# EAGLE schematic VA-Meter (EAGLE 6.6.0)
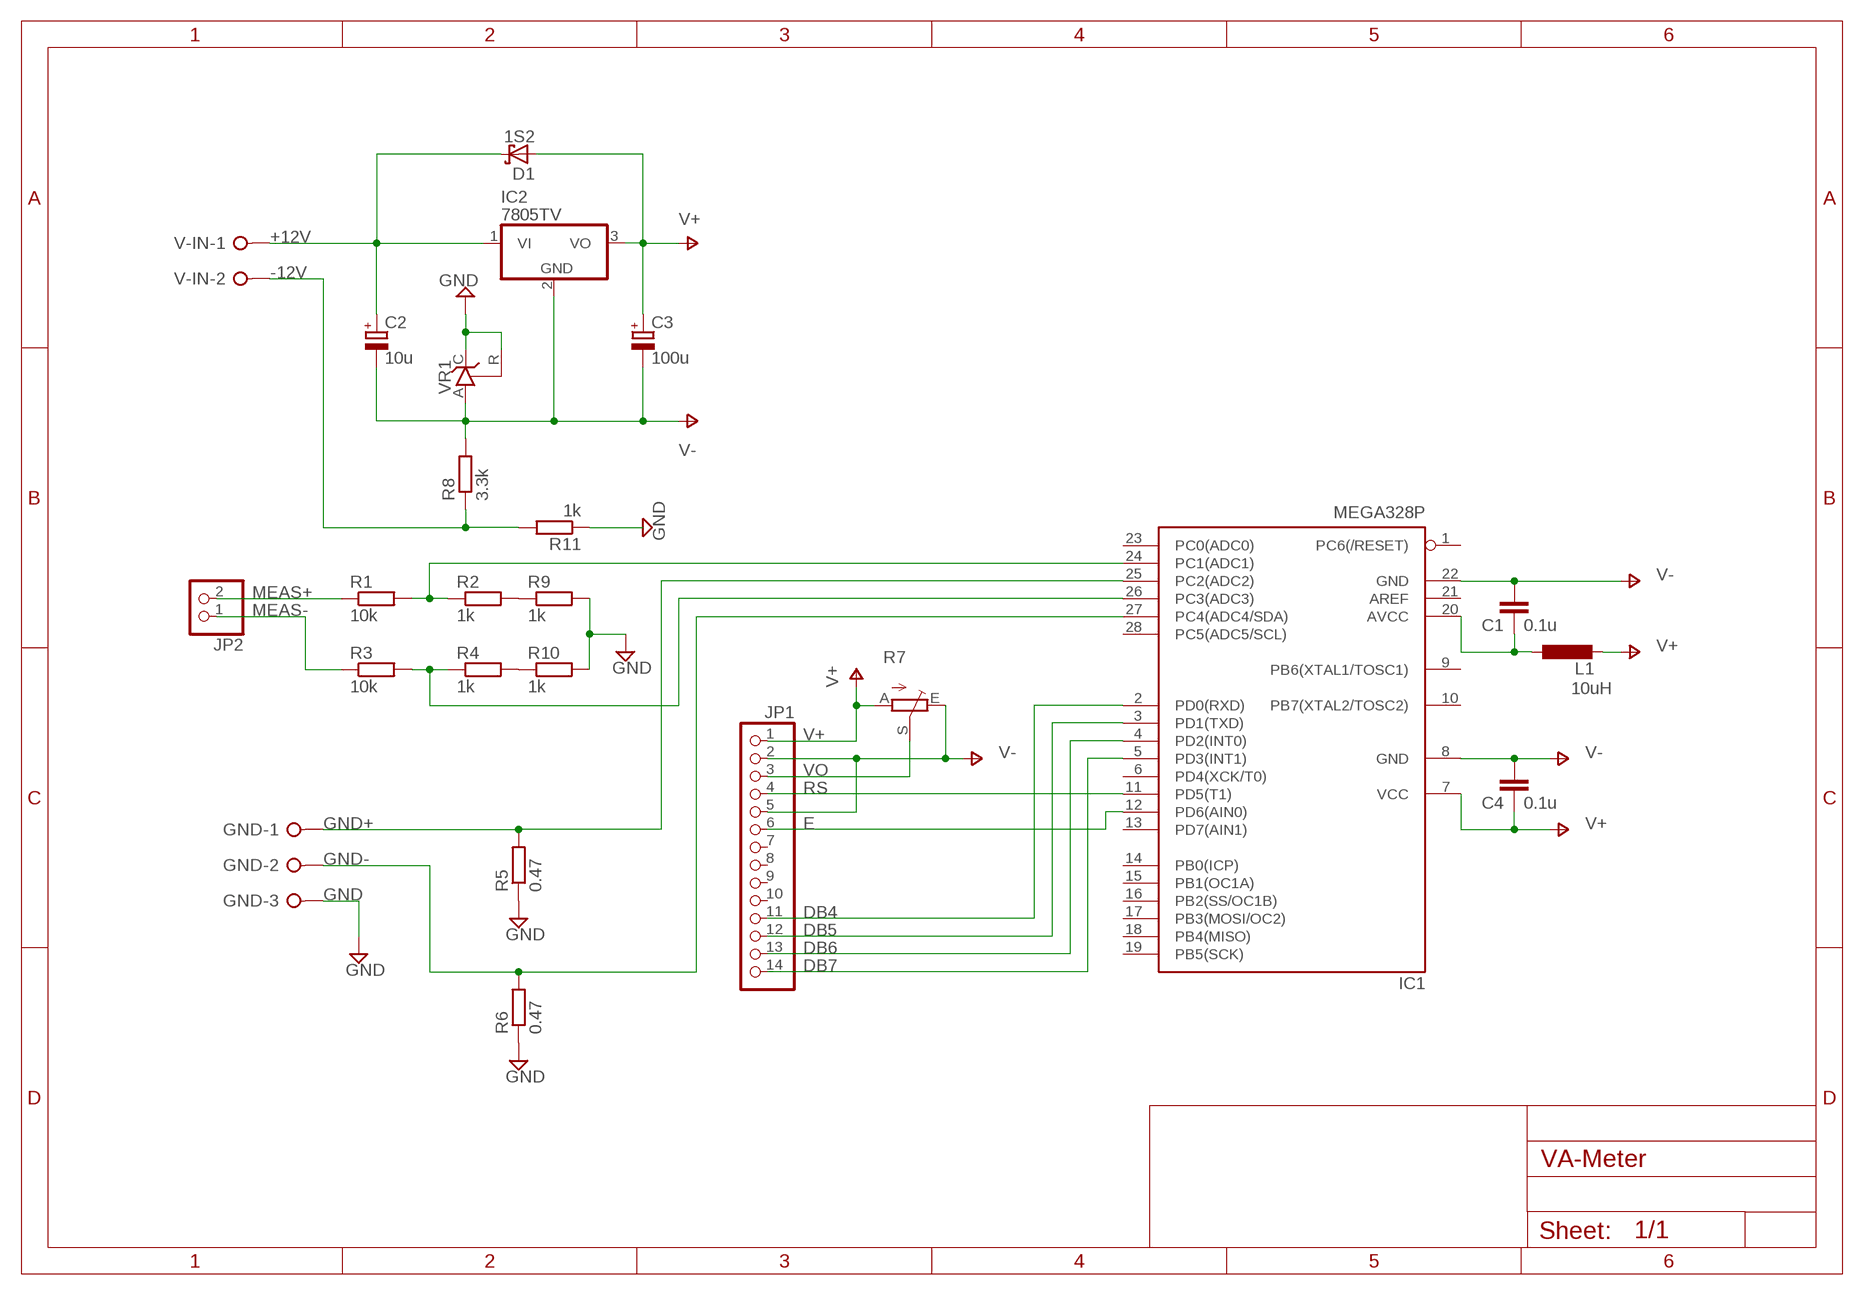
[diagram p0: schematic, sheet 1]

## Parts
C1  0.1u  C-EU050-024X044  [C050-024X044]
C2  10u  CPOL-EUE2.5-5  [E2,5-5]
C3  100u  CPOL-EUE2.5-6  [E2,5-6]
C4  0.1u  C-EU050-024X044  [C050-024X044]
D1  1S2  SCHOTTKY-DIODECB417-15  [CB417-15]
GND  W237-03P  [W237-133]
IC1  MEGA328P  [MEGA328P]
IC2  7805TV  [TO220V]
JP1  PINHD-1X14  [1X14]
JP2  PINHD-1X2  [1X02]
L1  10uH  L-EU6000-XXX-RC  [6000-XXXX-RC]
R1  10k  R-EU_0207/7  [0207/7]
R2  1k  R-EU_0207/7  [0207/7]
R3  10k  R-EU_0207/7  [0207/7]
R4  1k  R-EU_0207/7  [0207/7]
R5  0.47  R-EU_0613/15  [P0613/15]
R6  0.47  R-EU_0613/15  [P0613/15]
R7  TRIM_EU-B25P  [B25P]
R8  3.3k  R-EU_0613/15  [P0613/15]
R9  1k  R-EU_0207/7  [0207/7]
R10  1k  R-EU_0207/7  [0207/7]
R11  1k  R-EU_0613/15  [P0613/15]
V-IN  W237-02P  [W237-132]
VR1  TL431CLP  [TO92-CLP]

## Nets
+12V: C2.+ D1.C IC2.1(VI) V-IN.1
-12V: R8.1 R11.2 V-IN.2
DB4: IC1.2(PD0(RXD)) JP1.11
DB5: IC1.3(PD1(TXD)) JP1.12
DB6: IC1.4(PD2(INT0)) JP1.13
DB7: IC1.5(PD3(INT1)) JP1.14
E: IC1.12(PD6(AIN0)) JP1.6
GND: GND.3 R5.1 R6.1 R9.2 R10.2 VR1.C VR1.R
GND+: GND.1 IC1.25(PC2(ADC2)) R5.2
GND-: GND.2 IC1.27(PC4(ADC4/SDA)) R6.2
MEAS+: JP2.2 R1.1
MEAS-: JP2.1 R3.1
N$1: R11.1
N$3: IC1.24(PC1(ADC1)) R1.2 R2.1
N$4: IC1.26(PC3(ADC3)) R3.2 R4.1
N$14: R2.2 R9.1
N$16: C1.1 IC1.20(AVCC) L1.1
N$17: R4.2 R10.1
RS: IC1.11(PD5(T1)) JP1.4
V+: C3.+ C4.1 D1.A IC1.7(VCC) IC2.3(VO) JP1.1 L1.2 R7.A
V-: C1.2 C2.- C3.- C4.2 IC1.8(GND) IC1.22(GND) IC2.2(GND) JP1.2 JP1.5 R7.E R8.2 VR1.A
VO: JP1.3 R7.S
Unconnected: IC1.1(PC6(/RESET)) IC1.6(PD4(XCK/T0)) IC1.9(PB6(XTAL1/TOSC1)) IC1.10(PB7(XTAL2/TOSC2)) IC1.13(PD7(AIN1)) IC1.14(PB0(ICP)) IC1.15(PB1(OC1A)) IC1.16(PB2(SS/OC1B)) IC1.17(PB3(MOSI/OC2)) IC1.18(PB4(MISO)) IC1.19(PB5(SCK)) IC1.21(AREF) IC1.23(PC0(ADC0)) IC1.28(PC5(ADC5/SCL)) JP1.7 JP1.8 JP1.9 JP1.10

## Library data of the parts
C1 C4 = rcl:C-EU: CAPACITOR, European symbol
C2 C3 = rcl:CPOL-EU: POLARIZED CAPACITOR, European symbol
D1 = diode:SCHOTTKY-DIODE: Schottky Diode
GND = con-wago-508:W237-03P: WAGO SREW CLAMP; OC_FARNELL: unknown; OC_NEWARK: unknown
IC1 = Mylib:MEGA328P: ATMega328P
IC2 = linear:78*: Positive VOLTAGE REGULATOR Source: http://cache.national.com/ds/LM/LM78L05.pdf http://www.fairchildsemi.com/ds/LM/LM7805.pdf
JP1 = pinhead:PINHD-1X14: PIN HEADER
JP2 = pinhead:PINHD-1X2: PIN HEADER
L1 = rcl:L-EU: INDUCTOR, European symbol
R1-R6 R8-R11 = rcl:R-EU_: RESISTOR, European symbol
R7 = pot:TRIM_EU-: POTENTIOMETER
V-IN = con-wago-508:W237-02P: WAGO SREW CLAMP; OC_FARNELL: unknown; OC_NEWARK: unknown
VR1 = v-reg:TL431CLP: VOLTAGE REGULATOR